# EAGLE design CFO_europroto_atmega328_mcp4822 (EAGLE 9.2.2)
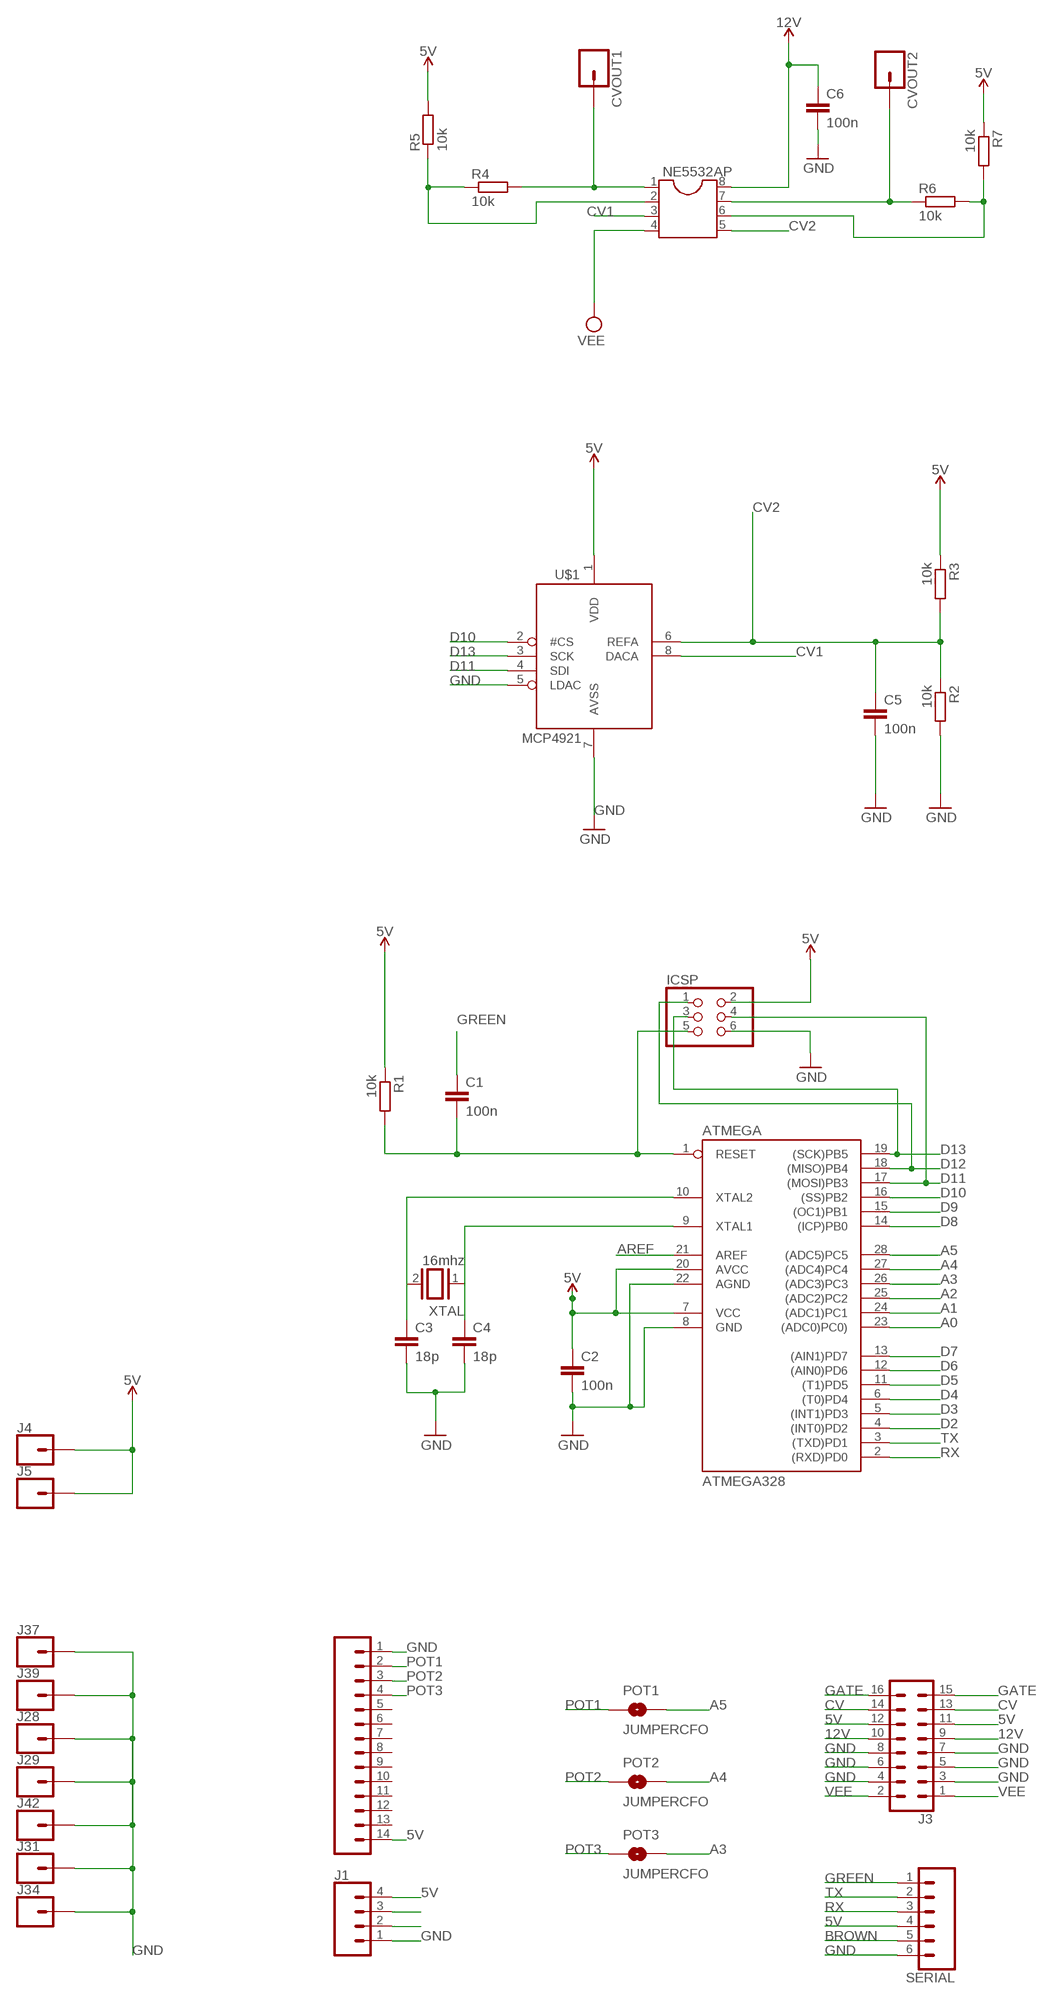
[diagram p0: schematic, sheet 1]

## Parts
ATMEGA  ATMEGA328  AT90S4433P  [DIL28-3]
C1  100n  C-EU050-025X075  [C050-025X075]
C2  100n  C-EU050-025X075  [C050-025X075]
C3  18p  C-EU050-025X075  [C050-025X075]
C4  18p  C-EU050-025X075  [C050-025X075]
C5  100n  C-EU050-025X075  [C050-025X075]
C6  100n  C-EU050-025X075  [C050-025X075]
CVOUT1  CONN_01  [1X01]
CVOUT2  CONN_01  [1X01]
ICSP  PINHD-2X3  [2X03]
J1  CONN_04  [1X04]
J2  CONN_14SQUARE  [1X14]
J3  CONN_08X2_SHROUD  [2X8-SHROUDED_LOCK]
J4  CONN_01  [1X01]
J5  CONN_01  [1X01]
J28  CONN_01  [1X01]
J29  CONN_01  [1X01]
J31  CONN_01  [1X01]
J34  CONN_01  [1X01]
J37  CONN_01  [1X01]
J39  CONN_01  [1X01]
J42  CONN_01  [1X01]
NE5532AP  DIL8  [DIL08]
POT1  JUMPERCFO  [SMT-JUMPER_2_NO_NO-SILK_ROUND]
POT2  JUMPERCFO  [SMT-JUMPER_2_NO_NO-SILK_ROUND]
POT3  JUMPERCFO  [SMT-JUMPER_2_NO_NO-SILK_ROUND]
R1  10k  R-EU_0207/10  [0207/10]
R2  10k  R-EU_0207/10  [0207/10]
R3  10k  R-EU_0207/10  [0207/10]
R4  10k  R-EU_0207/10  [0207/10]
R5  10k  R-EU_0207/10  [0207/10]
R6  10k  R-EU_0207/10  [0207/10]
R7  10k  R-EU_0207/10  [0207/10]
SERIAL  CONN_06SILK_FEMALE_PTH  [1X06]
U$1  MCP4921  [DIL08]
XTAL  16mhz  XTAL/S  [QS]

## Nets
5V: ATMEGA.7(VCC) ATMEGA.20(AVCC) C2.1 ICSP.2 J1.4 J2.14 J3.11 J3.12 J4.1 J5.1 R1.1 R3.1 R5.2 R7.1 SERIAL.4 U$1.1(VDD)
12V: C6.1 J3.9 J3.10 NE5532AP.8
A0: ATMEGA.23((ADC0)PC0))
A1: ATMEGA.24((ADC1)PC1)
A2: ATMEGA.25((ADC2)PC2)
A3: ATMEGA.26((ADC3)PC3) POT3.2
A4: ATMEGA.27((ADC4)PC4) POT2.2
A5: ATMEGA.28((ADC5)PC5) POT1.2
AREF: ATMEGA.21(AREF)
BROWN: SERIAL.5
CV: J3.13 J3.14
CV1: NE5532AP.3 U$1.8(DACA)
CV2: C5.1 NE5532AP.5 R2.1 R3.2 U$1.6(REFA)
CVOUT1: CVOUT1.1 NE5532AP.1 R4.2
CVOUT2: CVOUT2.1 NE5532AP.7 R6.1
D2: ATMEGA.4((INT0)PD2)
D3: ATMEGA.5((INT1)PD3)
D4: ATMEGA.6((T0)PD4)
D5: ATMEGA.11((T1)PD5)
D6: ATMEGA.12((AIN0)PD6)
D7: ATMEGA.13((AIN1)PD7)
D8: ATMEGA.14((ICP)PB0)
D9: ATMEGA.15((OC1)PB1)
D10: ATMEGA.16((SS)PB2) U$1.2(#CS)
D11: ATMEGA.17((MOSI)PB3) ICSP.4 U$1.4(SDI)
D12: ATMEGA.18((MISO)PB4) ICSP.1
D13: ATMEGA.19((SCK)PB5) ICSP.3 U$1.3(SCK)
GATE: J3.15 J3.16
GND: ATMEGA.8(GND) ATMEGA.22(AGND) C2.2 C3.2 C4.2 C5.2 C6.2 ICSP.6 J1.1 J2.1 J3.3 J3.4 J3.5 J3.6 J3.7 J3.8 J28.1 J29.1 J31.1 J34.1 J37.1 J39.1 J42.1 R2.2 SERIAL.6 U$1.5(LDAC) U$1.7(AVSS)
GREEN: C1.1 SERIAL.1
N$1: ATMEGA.10(XTAL2) C3.1 XTAL.2
N$2: NE5532AP.6 R6.2 R7.2
N$4: NE5532AP.2 R4.1 R5.1
N$9: ATMEGA.9(XTAL1) C4.1 XTAL.1
N$185: J1.3
N$186: J1.2
POT1: J2.2 POT1.1
POT2: J2.3 POT2.1
POT3: J2.4 POT3.1
RESET: ATMEGA.1(RESET) C1.2 ICSP.5 R1.2
RX: ATMEGA.2((RXD)PD0) SERIAL.3
TX: ATMEGA.3((TXD)PD1) SERIAL.2
VEE: J3.1 J3.2 NE5532AP.4
Unconnected: J2.5 J2.6 J2.7 J2.8 J2.9 J2.10 J2.11 J2.12 J2.13

## Library data of the parts
ATMEGA = atmel:AT90S4433: MICROCONTROLLER 4 Kbytes FLASH 128 bytes SRAM 256 bytes EEPROM UART 6-channel 10 bit ADC; OC_FARNELL: unknown; OC_NEWARK: unknown
C1-C6 = rcl:C-EU: CAPACITOR, European symbol; SPICEPREFIX: C
CVOUT1 CVOUT2 J4 J5 J28 J29 J31 J34 J37 J39 J42 = CFO:CONN_01: Single connection point. Often used as Generic Header-pin footprint for 0.1 inch spaced/style header connections On any of the 0.1 inch spaced packages, you can populate with these: Break Away Headers - Straight <https://www.sparkfun.com/products/116> (PRT-00116) Break Away Male Headers - Right Angle <https://www.sparkfun.com/products/553> (PRT-00553) Female Headers <https://www.sparkfun.com/products/115> (PRT-00115) Break Away Headers - Machine Pin <https://www.sparkfun.com/products/117> (PRT-00117) Break Away Female Headers - Swiss Machine Pin <https://www.sparkfun.com/products/743> (PRT-00743) This device is also useful as a general connection point to wire up your design to another part of your project. Our various solder wires solder well into these plated through hole pads. Hook-Up Wire - Assortment (Stranded, 22 AWG) <https://www.sparkfun.com/products/11375> (PRT-11375) Hook-Up Wire - Assortment (Solid Core, 22 AWG) <https://www.sparkfun.com/products/11367> (PRT-11367) View the entire wire category on our website here <https://www.sparkfun.com/categories/141> Special notes: SMTSO-256-ET is a "flush mount" nut for a 4-40 screw. We mostly use this on specialty testbeds; it is a nice way to connect hardware to your PCB at an adjustable hieght. Also note, the SNAP packages are for using a snappable style connector. We sell a baggie of snaps and they are also used on two LilyPad designs: Snap Assortment - 30 pack (male and female) <https://www.sparkfun.com/products/11347> (DEV-11347) LilyPad Arduino SimpleSnap <https://www.sparkfun.com/products/10941> (DEV-10941) LilyPad SimpleSnap Protoboard <https://www.sparkfun.com/products/10940> (DEV-10940)
ICSP = SparkFun-Connectors:PINHD-2X3: PIN HEADER
J1 = CFO:CONN_04: Multi connection point. Often used as Generic Header-pin footprint for 0.1 inch spaced/style header connections On any of the 0.1 inch spaced packages, you can populate with these: Break Away Headers - Straight <https://www.sparkfun.com/products/116> (PRT-00116) Break Away Male Headers - Right Angle <https://www.sparkfun.com/products/553> (PRT-00553) Female Headers <https://www.sparkfun.com/products/115> (PRT-00115) Break Away Headers - Machine Pin <https://www.sparkfun.com/products/117> (PRT-00117) Break Away Female Headers - Swiss Machine Pin <https://www.sparkfun.com/products/743> (PRT-00743) For SCREWTERMINALS and SPRING TERMINALS visit here: Screw Terimnals on SparkFun.com <https://www.sparkfun.com/search/results?term=Screw+Terminals> (5mm/3.5mm/2.54mm spacing) This device is also useful as a general connection point to wire up your design to another part of your project. Our various solder wires solder well into these plated through hole pads. Hook-Up Wire - Assortment (Stranded, 22 AWG) <https://www.sparkfun.com/products/11375> (PRT-11375) Hook-Up Wire - Assortment (Solid Core, 22 AWG) <https://www.sparkfun.com/products/11367> (PRT-11367) View the entire wire category on our website here <https://www.sparkfun.com/categories/141> Special notes: Molex polarized connector foot print use with SKU : PRT-08231 with associated crimp pins and housings. 1MM SMD Version SKU: PRT-10208; PROD_ID: CONN-09696; SPICEPREFIX: E
J2 = CFO:CONN_14: Multi connection point. Often used as Generic Header-pin footprint for 0.1 inch spaced/style header connections On any of the 0.1 inch spaced packages, you can populate with these: Break Away Headers - Straight <https://www.sparkfun.com/products/116> (PRT-00116) Break Away Male Headers - Right Angle <https://www.sparkfun.com/products/553> (PRT-00553) Female Headers <https://www.sparkfun.com/products/115> (PRT-00115) Break Away Headers - Machine Pin <https://www.sparkfun.com/products/117> (PRT-00117) Break Away Female Headers - Swiss Machine Pin <https://www.sparkfun.com/products/743> (PRT-00743) For SCREWTERMINALS and SPRING TERMINALS visit here: Screw Terimnals on SparkFun.com <https://www.sparkfun.com/search/results?term=Screw+Terminals> (5mm/3.5mm/2.54mm spacing) This device is also useful as a general connection point to wire up your design to another part of your project. Our various solder wires solder well into these plated through hole pads. Hook-Up Wire - Assortment (Stranded, 22 AWG) <https://www.sparkfun.com/products/11375> (PRT-11375) Hook-Up Wire - Assortment (Solid Core, 22 AWG) <https://www.sparkfun.com/products/11367> (PRT-11367) View the entire wire category on our website here <https://www.sparkfun.com/categories/141> Special notes: Molex polarized connector foot print use with SKU : PRT-08231 with associated crimp pins and housings. 1MM SMD Version SKU: PRT-10208 NOTES ON THE VARIANTS LOCK and LOCK_LONGPADS... This footprint was designed to help hold the alignment of a through-hole component (i.e. 6-pin header) while soldering it into place. You may notice that each hole has been shifted either up or down by 0.005 of an inch from it's more standard position (which is a perfectly straight line). This slight alteration caused the pins (the squares in the middle) to touch the edges of the holes. Because they are alternating, it causes a "brace" to hold the component in place. 0.005 has proven to be the perfect amount of "off-center" position when using our standard breakaway headers. Although looks a little odd when you look at the bare footprint, once you have a header in there, the alteration is very hard to notice. Also,if you push a header all the way into place, it is covered up entirely on the bottom side.; SPICEPREFIX: X
J3 = CFO:CONN_08X2: Multi connection point. Often used as Generic Header-pin footprint for 0.1 inch spaced/style header connections You can populate with any combo of single row headers, but if you'd like an exact match, check this: Header - 2x8 (Male, 0.1") <https://www.sparkfun.com/products/13156> (PRT-13156) On any of the 0.1 inch spaced packages, you can populate with these: Break Away Headers - Straight <https://www.sparkfun.com/products/116> (PRT-00116) Break Away Male Headers - Right Angle <https://www.sparkfun.com/products/553> (PRT-00553) Female Headers <https://www.sparkfun.com/products/115> (PRT-00115) Break Away Headers - Machine Pin <https://www.sparkfun.com/products/117> (PRT-00117) Break Away Female Headers - Swiss Machine Pin <https://www.sparkfun.com/products/743> (PRT-00743)
NE5532AP = ic-package:DIL8: Dual In Line / Socket
POT1-POT3 = CFO:JUMPER: Normally open jumper This jumper has two pads in close proximity to each other. Apply solder to close the connection.
R1-R7 = rcl:R-EU_: RESISTOR, European symbol; SPICEPREFIX: R
SERIAL = SparkFun-Connectors:CONN_06: Multi connection point. Often used as Generic Header-pin footprint for 0.1 inch spaced/style header connections On any of the 0.1 inch spaced packages, you can populate with these: Break Away Headers - Straight <https://www.sparkfun.com/products/116> (PRT-00116) Break Away Male Headers - Right Angle <https://www.sparkfun.com/products/553> (PRT-00553) Female Headers <https://www.sparkfun.com/products/115> (PRT-00115) Break Away Headers - Machine Pin <https://www.sparkfun.com/products/117> (PRT-00117) Break Away Female Headers - Swiss Machine Pin <https://www.sparkfun.com/products/743> (PRT-00743) Arduino Stackable Header - 6 Pin <https://www.sparkfun.com/products/9280> (PRT-09280) For SCREWTERMINALS and SPRING TERMINALS visit here: Screw Terimnals on SparkFun.com <https://www.sparkfun.com/search/results?term=Screw+Terminals> (5mm/3.5mm/2.54mm spacing) This device is also useful as a general connection point to wire up your design to another part of your project. Our various solder wires solder well into these plated through hole pads. Hook-Up Wire - Assortment (Stranded, 22 AWG) <https://www.sparkfun.com/products/11375> (PRT-11375) Hook-Up Wire - Assortment (Solid Core, 22 AWG) <https://www.sparkfun.com/products/11367> (PRT-11367) View the entire wire category on our website here <https://www.sparkfun.com/categories/141>; PROD_ID: CONN-08437
U$1 = adafruit:MCP4921
XTAL = special:XTAL/S: CRYSTAL

## Board
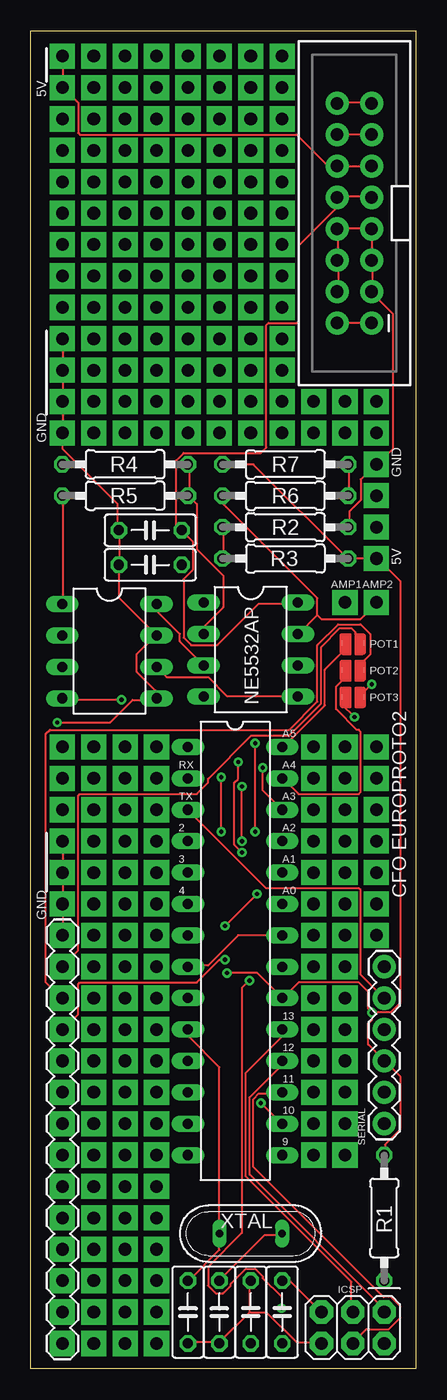
[diagram p1: board, top side]
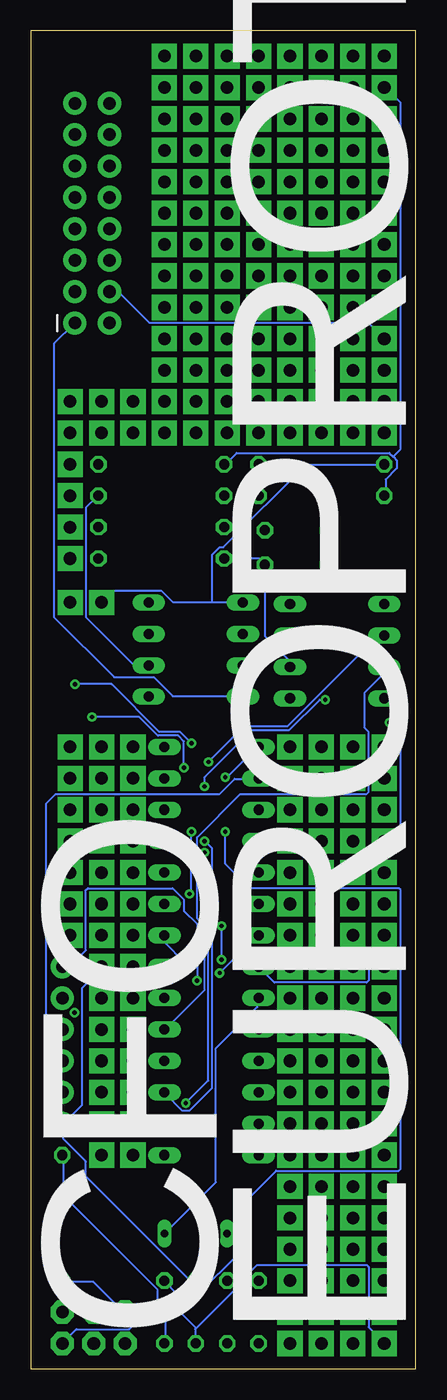
[diagram p2: board, bottom side, seen from below]

Size 31.11 x 108.22 mm. Coordinates in mm from the lower left corner, seen from the top.
Outline: 31.11,0 0,0 0,108.22 31.11,108.22 31.11,0
Copper layers (1*16): Top 0.035mm / dielectric 1.5mm / Bottom 0.035mm
Design rules "default": minimum track width 6mil, minimum drill 0.35mm, track to track 6mil, track to pad 6mil, pad to pad 6mil, via to via 6mil, smd to smd 6mil, copper to edge 40mil, drill to drill 6mil, minimum pad ring 10mil, minimum via ring 8mil, stop-mask expansion 4mil, vias tented up to drill 0mil, thermal gap 10mil

### Footprints (pad centres in the part's own frame; a part is rotated, then mirrored left to right if it is on the bottom)
DIL28-3 = drill 0.813 long: 1 -16.51,-3.81; 2 -13.97,-3.81; 3 -11.43,-3.81; 4 -8.89,-3.81; 5 -6.35,-3.81; 6 -3.81,-3.81; 7 -1.27,-3.81; 8 1.27,-3.81; 9 3.81,-3.81; 10 6.35,-3.81; 11 8.89,-3.81; 12 11.43,-3.81; 13 13.97,-3.81; 14 16.51,-3.81; 15 16.51,3.81; 16 13.97,3.81; 17 11.43,3.81; 18 8.89,3.81; 19 6.35,3.81; 20 3.81,3.81; 21 1.27,3.81; 22 -1.27,3.81; 23 -3.81,3.81; 24 -6.35,3.81; 25 -8.89,3.81; 26 -11.43,3.81; 27 -13.97,3.81; 28 -16.51,3.81
C050-025X075 = drill 0.813 octagon: 1 -2.54,0; 2 2.54,0
1X01 = drill 1.016 pad 2.032 square: 1 0,0
2X03 = drill 1.016 pad 1.88 octagon: 1 -2.54,-1.27; 2 -2.54,1.27; 3 0,-1.27; 4 0,1.27; 5 2.54,-1.27; 6 2.54,1.27
1X04 = drill 1.016 pad 2.032 square: 1 0,0; 2 2.54,0; 3 5.08,0; 4 7.62,0
1X14 = drill 1.016 pad 2.032 square: 1 0,0; 2 2.54,0; 3 5.08,0; 4 7.62,0; 5 10.16,0; 6 12.7,0; 7 15.24,0; 8 17.78,0; 9 20.32,0; 10 22.86,0; 11 25.4,0; 12 27.94,0; 13 30.48,0; 14 33.02,0
2X8-SHROUDED_LOCK = drill 1.016 pad 1.88: 1 -1.397,8.89; 2 1.397,8.89; 3 -1.397,6.35; 4 1.397,6.35; 5 -1.397,3.81; 6 1.397,3.81; 7 -1.397,1.27; 8 1.397,1.27; 9 -1.397,-1.27; 10 1.397,-1.27; 11 -1.397,-3.81; 12 1.397,-3.81; 13 -1.397,-6.35; 14 1.397,-6.35; 15 -1.397,-8.89; 16 1.397,-8.89
DIL08 = drill 0.813 long: 1 -3.81,-3.81; 2 -1.27,-3.81; 3 1.27,-3.81; 4 3.81,-3.81; 5 3.81,3.81; 6 1.27,3.81; 7 -1.27,3.81; 8 -3.81,3.81
SMT-JUMPER_2_NO_NO-SILK_ROUND = smd 0.152 x 0.305: 1 -0.889,0; 2 0.889,0
0207/10 = drill 0.813 octagon: 1 -5.08,0; 2 5.08,0
1X06 = drill 1.016 pad 1.88: 1 0,0; 2 2.54,0; 3 5.08,0; 4 7.62,0; 5 10.16,0; 6 12.7,0
QS = drill 0.61 long: 1 -2.54,0; 2 2.54,0

### Placement (x,y rotation side)
ATMEGA  16.51,33.78 270 top
C1  20.32,4.57 90 top
C2  17.78,4.57 90 top
C3  12.7,4.57 270 top
C4  15.24,4.57 270 top
C5  9.65,65.02 180 top
C6  9.65,67.82 180 top
CVOUT1  25.4,61.98 90 top
CVOUT2  27.94,61.98 90 top
ICSP  26.04,3.3 180 top
J1  27.94,73.15 270 top
J2  2.54,35.05 270 top
J3  26.16,93.47 180 top
J4  2.54,106.17 0 top
J5  2.54,103.63 0 top
J28  2.54,83.31 0 top
J29  2.54,42.67 0 top
J31  2.54,80.77 0 top
J34  2.54,78.23 0 top
J37  2.54,75.69 0 top
J39  2.54,40.13 0 top
J42  2.54,37.59 0 top
NE5532AP  17.78,58.17 270 top
POT1  26.04,58.67 180 top
POT2  26.04,56.52 180 top
POT3  26.04,54.36 180 top
R1  28.57,12.19 270 top
R2  20.57,68.07 0 top
R3  20.57,65.53 180 top
R4  7.62,73.15 180 top
R5  7.62,70.61 180 top
R6  20.57,70.61 0 top
R7  20.57,73.15 0 top
SERIAL  28.57,32.51 270 top
U$1  6.35,58.04 270 top
XTAL  17.78,10.92 180 top

### Tracks (layer width: path | path; a pad name or v marks a point on that pad's centre or on a via)
5V  (via drill 0.35)
  Top 0.152: v27.58,28.8 27.58,28.19 27.28,27.89 27.28,26.21 28.5,24.99 SERIAL.4 28.65,24.84 29.87,23.62 29.87,19.36 28.65,18.14 28.65,17.37 R1.1 | v27.58,28.8 27.28,29.11 27.28,30.48 26.52,31.24 21.64,31.24 20.42,30.02 ATMEGA.20 18.29,32 v15.85,32 | J3.11 27.43,97.23 24.84,97.23 J3.12 24.69,97.38 23.93,97.38 21.49,99.82 3.96,99.82 3.81,99.97 3.81,102.41 2.59,103.63 | 2.59,103.63 2.59,106.07 J4.1 | 2.59,103.63 J5.1 | U$1.1 2.59,61.87 2.59,70.56 R5.2 | R7.1 17.98,73.15 25.6,65.53 R3.1 J1.4 28.04,65.53 29.87,63.7 29.87,29.57 29.11,28.8 v27.58,28.8
  Bottom 0.152: 17.83,3.2 17.83,3.35 19.96,5.49 20.88,5.49 | 17.83,3.2 17.83,2.13 C2.1 | 20.88,5.49 23.16,3.2 27.43,3.2 28.5,2.13 ICSP.2 | 17.83,3.2 14.33,6.71 14.33,6.86 12.8,8.38 3.96,8.38 3.81,8.23 3.81,3.35 2.59,2.13 J2.14 | v15.85,32 12.8,35.05 ATMEGA.7 | 20.88,5.49 20.88,6.4 28.5,14.02 28.5,17.22 R1.1 | 1.83,73.76 2.13,74.07 14.48,74.07 15.39,73.15 R7.1 | 1.83,73.76 1.52,73.46 1.52,72.85 2.44,71.93 2.44,70.71 R5.2 | 1.83,73.76 1.22,74.37 1.22,102.41 2.44,103.63 J5.1
12V
  Top 0.152: J3.9 27.43,94.79 24.84,94.79 J3.10 24.69,94.64 24.69,93.88 21.64,90.83 21.64,84.73 21.49,84.58 19.2,84.58 19.05,84.43 19.05,74.52 18.59,74.07 12.34,74.07 11.73,73.46 11.73,68.28 C6.1 13.11,66.9 13.11,64.62 12.34,63.86 12.34,59.13 12.95,58.52 15.09,58.52 18.44,61.87 21.49,61.87 NE5532AP.8
A3  (via drill 0.35)
  Top 0.152: v18.75,48.62 18.75,46.79 ATMEGA.26 | POT3.2 25.15,53.74 v26.17,52.72
  Bottom 0.152: v18.75,48.62 18.75,50.75 19.2,51.21 20.85,51.21 22.36,52.72 v26.17,52.72
A4
  Top 0.152: POT2.2 25.15,55.63 24.69,55.17 24.69,53.34 26.36,51.66 26.52,51.66 26.67,51.51 26.67,46.63 26.52,46.48 21.64,46.48 20.42,47.7 ATMEGA.27
A5
  Top 0.152: POT1.2 25.15,57.91 23.77,56.54 23.77,53.65 20.42,50.29 ATMEGA.28
CV
  Top 0.152: J3.13 J3.14
CV1
  Top 0.152: NE5532AP.3 12.04,58.83 12.04,59.44 10.21,61.27 10.21,61.72 U$1.8
CV2
  Top 0.152: R3.2 15.54,65.53 15.54,67.97 R2.1 | NE5532AP.5 21.49,54.41 15.85,54.41 14.33,55.93 10.97,55.93 10.21,56.69 U$1.6
  Bottom 0.152: U$1.6 10.21,56.84 10.21,57.3 12.19,59.28 C5.1 12.19,65.08 12.65,65.53 R3.2
CVOUT1
  Bottom 0.152: 16.46,62.03 19.66,62.03 20.57,62.94 24.38,62.94 25.3,62.03 CVOUT1.1 | 16.46,62.03 14.02,62.03 NE5532AP.1 | R4.2 8.84,73.15 15.54,66.45 15.85,66.45 16.46,65.84 16.46,62.03
CVOUT2
  Top 0.152: 23.16,60.96 23.16,62.33 15.54,69.95 15.54,70.56 R6.1 | 23.16,60.96 21.64,59.44 NE5532AP.7 | 23.16,60.96 23.47,60.66 26.67,60.66 27.89,61.87 CVOUT2.1
D10  (via drill 0.35)
  Top 0.152: v16.76,49.07 16.76,47.7 16.46,47.4 16.46,42.37 v17.07,41.76 | v18.59,21.49 20.27,19.81 ATMEGA.16
  Bottom 0.152: v16.76,49.07 13.87,51.97 10.36,51.97 3.05,59.28 2.59,59.28 U$1.2 | v17.07,41.76 17.07,36.27 16.76,35.97 16.76,23.32 v18.59,21.49
D11  (via drill 0.35)
  Top 0.152: ATMEGA.17 20.27,22.25 18.44,22.25 17.98,21.79 17.98,16.31 28.5,5.79 29.11,5.79 29.87,5.03 29.87,4.12 28.96,3.2 27.13,3.2 26.06,2.13 ICSP.4 | v7.32,54.1 2.59,54.1 U$1.4 | v17.07,42.67 v17.07,47.09
  Bottom 0.152: v7.32,54.1 7.77,54.1 10.21,51.66 13.26,51.66 17.07,47.85 v17.07,47.09 | v17.07,42.67 16.46,42.06 16.46,22.71 18.29,20.88 18.9,20.88 20.27,22.25 ATMEGA.17
D12
  Top 0.152: ATMEGA.18 20.27,24.84 20.27,24.54 17.68,21.95 17.68,15.7 28.5,4.88 28.5,4.57 ICSP.1
D13
  Top 0.152: ATMEGA.19 20.27,27.43 20.27,26.82 17.37,23.93 17.37,15.54 25.91,7.01 25.91,4.57 ICSP.3
  Bottom 0.152: U$1.3 2.59,56.69 2.59,56.24 4.12,54.71 4.12,51.82 3.81,51.51 3.81,46.63 3.96,46.48 14.17,46.48 17.68,42.98 17.68,36.42 17.07,35.81 17.07,30.63 20.27,27.43 ATMEGA.19
GATE
  Top 0.152: J3.16 24.84,102.41 27.43,102.41 J3.15
GND  (via drill 0.35)
  Top 0.152: R2.2 25.76,68.12 25.76,69.34 26.67,70.26 26.67,71.93 27.89,73.15 J1.1 28.04,73.15 29.26,74.37 29.26,85.34 27.58,87.02 J3.3 27.58,87.17 27.58,89.61 J3.5 27.58,89.76 27.58,92.2 J3.7 24.84,92.2 | J3.4 24.84,87.17 24.84,89.61 J3.6 24.84,89.76 24.84,92.2 | 24.84,92.2 J3.8 | 2.59,80.77 2.59,83.21 J28.1 | 2.59,80.77 2.59,78.33 J34.1 2.59,78.18 2.59,75.74 J37.1 2.59,75.59 2.59,74.37 7.01,69.95 7.01,67.82 C6.2 7.16,67.82 7.16,65.08 C5.2 7.16,64.92 7.16,62.33 10.06,59.44 U$1.7 10.06,59.28 8.53,57.76 8.53,56.39 10.06,54.86 10.06,54.25 U$1.5 10.06,54.1 8.23,54.1 6.4,52.27 v2.13,52.27 | 2.59,80.77 J31.1 | ATMEGA.22 16.76,35.05 14.33,32.61 12.8,32.61 ATMEGA.8 | J2.1 2.59,35.05 2.59,37.49 J42.1 2.59,37.64 2.59,40.08 J39.1 2.59,40.23 2.59,42.67 J29.1 | 15.24,2.13 12.8,2.13 C3.2 | 17.68,4.57 17.68,7.01 C2.2 | 15.24,2.13 17.68,4.57 | 15.24,2.13 C4.2 | 17.68,4.57 19.05,4.57 21.49,2.13 23.47,2.13 ICSP.6
  Bottom 0.152: J28.1 3.81,84.58 21.49,84.58 23.93,87.02 24.69,87.02 J3.4 | ATMEGA.8 11.43,31.24 3.96,31.24 3.81,31.39 3.81,33.83 2.59,35.05 J2.1 | 28.5,19.81 28.5,18.59 26.67,16.76 26.67,15.54 18.29,7.16 17.83,7.16 C2.2 | 28.5,19.81 26.98,21.34 26.98,30.79 26.52,31.24 19.66,31.24 18.75,32.16 18.75,32.92 20.27,34.44 20.27,35.05 ATMEGA.22 | 28.5,19.81 SERIAL.6 | v2.13,52.27 1.22,51.36 1.22,43.89 2.44,42.67 J29.1
GREEN  (via drill 0.35)
  Top 0.152: v20.27,4.88 20.27,5.79 18.75,7.32 18.75,7.47 18.14,8.08 17.37,8.08 16.15,6.86 16.15,6.71 15.54,6.1 14.94,6.1 14.33,6.71 14.33,8.23 17.07,10.97 17.07,30.79 v17.68,31.39
  Bottom 0.152: v20.27,4.88 20.27,2.13 C1.1 | v17.68,31.39 17.68,35.97 18.75,37.03 18.75,37.95 19.66,38.86 26.52,38.86 26.67,38.71 26.67,33.83 27.89,32.61 28.5,32.61 SERIAL.1
N$1
  Top 0.152: C3.1 12.8,7.16 15.24,9.6 XTAL.2 15.24,24.38 12.8,26.82 12.8,27.43 ATMEGA.10
N$2
  Top 0.152: R7.2 25.76,73.15 25.76,70.71 R6.2
  Bottom 0.152: NE5532AP.6 21.64,57 22.86,57 26.67,60.81 26.67,69.65 25.76,70.56 R6.2
N$3  (via drill 1.02 pad 2.03)
  other vias: 5.08,2.03
N$4
  Top 0.152: R4.1 12.8,73.15 12.8,70.71 R5.1 12.8,70.56 13.41,69.95 13.41,66.29 15.54,64.16 15.54,61.57 14.02,60.05 14.02,59.44 NE5532AP.2
N$5  (via drill 1.02 pad 2.03)
  other vias: 7.62,2.03
N$6  (via drill 1.02 pad 2.03)
  other vias: 10.16,2.03
N$7  (via drill 1.02 pad 2.03)
  other vias: 10.16,4.57
N$8  (via drill 1.02 pad 2.03)
  other vias: 7.62,4.57
N$9
  Top 0.152: XTAL.1 20.27,10.82 18.9,10.82 15.24,7.16 C4.1
  Bottom 0.152: XTAL.1 16.15,15.09 16.15,25.91 12.8,29.26 12.8,29.87 ATMEGA.9
N$10  (via drill 1.02 pad 2.03)
  other vias: 5.08,4.57
N$11  (via drill 1.02 pad 2.03)
  other vias: 5.08,7.11
N$12  (via drill 1.02 pad 2.03)
  other vias: 7.62,7.11
N$13  (via drill 1.02 pad 2.03)
  other vias: 10.16,7.11
N$14  (via drill 1.02 pad 2.03)
  other vias: 10.16,9.65
N$15  (via drill 1.02 pad 2.03)
  other vias: 7.62,9.65
N$16  (via drill 1.02 pad 2.03)
  other vias: 5.08,9.65
N$17  (via drill 1.02 pad 2.03)
  other vias: 5.08,12.19
N$18  (via drill 1.02 pad 2.03)
  other vias: 7.62,12.19
N$19  (via drill 1.02 pad 2.03)
  other vias: 10.16,12.19
N$20  (via drill 1.02 pad 2.03)
  other vias: 10.16,14.73
N$21  (via drill 1.02 pad 2.03)
  other vias: 7.62,14.73
N$22  (via drill 1.02 pad 2.03)
  other vias: 5.08,14.73
N$23  (via drill 1.02 pad 2.03)
  other vias: 5.08,17.27
N$24  (via drill 1.02 pad 2.03)
  other vias: 7.62,17.27
N$25  (via drill 1.02 pad 2.03)
  other vias: 10.16,17.27
N$26  (via drill 1.02 pad 2.03)
  other vias: 10.16,19.81
N$27  (via drill 1.02 pad 2.03)
  other vias: 7.62,19.81
N$28  (via drill 1.02 pad 2.03)
  other vias: 5.08,19.81
N$29  (via drill 1.02 pad 2.03)
  other vias: 5.08,22.35
N$30  (via drill 1.02 pad 2.03)
  other vias: 7.62,22.35
N$31  (via drill 1.02 pad 2.03)
  other vias: 10.16,22.35
N$32  (via drill 1.02 pad 2.03)
  other vias: 10.16,24.89
N$33  (via drill 1.02 pad 2.03)
  other vias: 7.62,24.89
N$34  (via drill 1.02 pad 2.03)
  other vias: 5.08,24.89
N$35  (via drill 1.02 pad 2.03)
  other vias: 5.08,27.43
N$36  (via drill 1.02 pad 2.03)
  other vias: 7.62,27.43
N$37  (via drill 1.02 pad 2.03)
  other vias: 10.16,27.43
N$38  (via drill 1.02 pad 2.03)
  other vias: 10.16,29.97
N$39  (via drill 1.02 pad 2.03)
  other vias: 7.62,29.97
N$40  (via drill 1.02 pad 2.03)
  other vias: 5.08,29.97
N$41  (via drill 1.02 pad 2.03)
  other vias: 5.08,32.51
N$42  (via drill 1.02 pad 2.03)
  other vias: 7.62,32.51
N$43  (via drill 1.02 pad 2.03)
  other vias: 10.16,32.51
N$44  (via drill 1.02 pad 2.03)
  other vias: 10.16,35.05
N$45  (via drill 1.02 pad 2.03)
  other vias: 7.62,35.05
N$46  (via drill 1.02 pad 2.03)
  other vias: 5.08,35.05
N$47  (via drill 1.02 pad 2.03)
  other vias: 5.08,37.59
N$48  (via drill 1.02 pad 2.03)
  other vias: 7.62,37.59
N$49  (via drill 1.02 pad 2.03)
  other vias: 10.16,37.59
N$50  (via drill 1.02 pad 2.03)
  other vias: 10.16,40.13
N$51  (via drill 1.02 pad 2.03)
  other vias: 7.62,40.13
N$52  (via drill 1.02 pad 2.03)
  other vias: 5.08,40.13
N$53  (via drill 1.02 pad 2.03)
  other vias: 5.08,42.67
N$54  (via drill 1.02 pad 2.03)
  other vias: 7.62,42.67
N$55  (via drill 1.02 pad 2.03)
  other vias: 10.16,42.67
N$56  (via drill 1.02 pad 2.03)
  other vias: 10.16,45.21
N$57  (via drill 1.02 pad 2.03)
  other vias: 7.62,45.21
N$58  (via drill 1.02 pad 2.03)
  other vias: 5.08,45.21
N$59  (via drill 1.02 pad 2.03)
  other vias: 2.54,45.21
N$60  (via drill 1.02 pad 2.03)
  other vias: 2.54,47.75
N$61  (via drill 1.02 pad 2.03)
  other vias: 5.08,47.75
N$62  (via drill 1.02 pad 2.03)
  other vias: 7.62,47.75
N$63  (via drill 1.02 pad 2.03)
  other vias: 10.16,47.75
N$64  (via drill 1.02 pad 2.03)
  other vias: 10.16,50.29
N$65  (via drill 1.02 pad 2.03)
  other vias: 7.62,50.29
N$66  (via drill 1.02 pad 2.03)
  other vias: 5.08,50.29
N$67  (via drill 1.02 pad 2.03)
  other vias: 2.54,50.29
N$68  (via drill 1.02 pad 2.03)
  other vias: 22.86,17.27
N$71  (via drill 1.02 pad 2.03)
  other vias: 25.4,17.27
N$72  (via drill 1.02 pad 2.03)
  other vias: 25.4,19.81
N$73  (via drill 1.02 pad 2.03)
  other vias: 22.86,19.81
N$74  (via drill 1.02 pad 2.03)
  other vias: 22.86,22.35
N$75  (via drill 1.02 pad 2.03)
  other vias: 25.4,22.35
N$76  (via drill 1.02 pad 2.03)
  other vias: 25.4,24.89
N$77  (via drill 1.02 pad 2.03)
  other vias: 22.86,24.89
N$78  (via drill 1.02 pad 2.03)
  other vias: 22.86,27.43
N$79  (via drill 1.02 pad 2.03)
  other vias: 25.4,27.43
N$80  (via drill 1.02 pad 2.03)
  other vias: 25.4,29.97
N$81  (via drill 1.02 pad 2.03)
  other vias: 22.86,29.97
N$82  (via drill 1.02 pad 2.03)
  other vias: 22.86,32.51
N$84  (via drill 1.02 pad 2.03)
  other vias: 25.4,32.51
N$85  (via drill 1.02 pad 2.03)
  other vias: 25.4,35.05
N$86  (via drill 1.02 pad 2.03)
  other vias: 22.86,35.05
N$87  (via drill 1.02 pad 2.03)
  other vias: 27.94,35.05
N$88  (via drill 1.02 pad 2.03)
  other vias: 27.94,37.59
N$89  (via drill 1.02 pad 2.03)
  other vias: 25.4,37.59
N$90  (via drill 1.02 pad 2.03)
  other vias: 22.86,37.59
N$91  (via drill 1.02 pad 2.03)
  other vias: 22.86,40.13
N$92  (via drill 1.02 pad 2.03)
  other vias: 25.4,40.13
N$93  (via drill 1.02 pad 2.03)
  other vias: 27.94,40.13
N$94  (via drill 1.02 pad 2.03)
  other vias: 27.94,42.67
N$95  (via drill 1.02 pad 2.03)
  other vias: 25.4,42.67
N$96  (via drill 1.02 pad 2.03)
  other vias: 22.86,42.67
N$97  (via drill 1.02 pad 2.03)
  other vias: 22.86,45.21
N$98  (via drill 1.02 pad 2.03)
  other vias: 25.4,45.21
N$99  (via drill 1.02 pad 2.03)
  other vias: 27.94,45.21
N$100  (via drill 1.02 pad 2.03)
  other vias: 27.94,47.75
N$101  (via drill 1.02 pad 2.03)
  other vias: 25.4,47.75
N$102  (via drill 1.02 pad 2.03)
  other vias: 22.86,47.75
N$103  (via drill 1.02 pad 2.03)
  other vias: 22.86,50.29
N$104  (via drill 1.02 pad 2.03)
  other vias: 25.4,50.29
N$105  (via drill 1.02 pad 2.03)
  other vias: 27.94,50.29
N$108  (via drill 1.02 pad 2.03)
  other vias: 5.08,106.17
N$109  (via drill 1.02 pad 2.03)
  other vias: 7.62,106.17
N$110  (via drill 1.02 pad 2.03)
  other vias: 10.16,106.17
N$111  (via drill 1.02 pad 2.03)
  other vias: 12.7,106.17
N$112  (via drill 1.02 pad 2.03)
  other vias: 15.24,106.17
N$113  (via drill 1.02 pad 2.03)
  other vias: 17.78,106.17
N$114  (via drill 1.02 pad 2.03)
  other vias: 20.32,106.17
N$115  (via drill 1.02 pad 2.03)
  other vias: 20.32,103.63
N$116  (via drill 1.02 pad 2.03)
  other vias: 17.78,103.63
N$117  (via drill 1.02 pad 2.03)
  other vias: 15.24,103.63
N$118  (via drill 1.02 pad 2.03)
  other vias: 12.7,103.63
N$119  (via drill 1.02 pad 2.03)
  other vias: 10.16,103.63
N$120  (via drill 1.02 pad 2.03)
  other vias: 7.62,103.63
N$121  (via drill 1.02 pad 2.03)
  other vias: 5.08,103.63
N$122  (via drill 1.02 pad 2.03)
  other vias: 5.08,101.09
N$123  (via drill 1.02 pad 2.03)
  other vias: 7.62,101.09
N$124  (via drill 1.02 pad 2.03)
  other vias: 10.16,101.09
N$125  (via drill 1.02 pad 2.03)
  other vias: 12.7,101.09
N$126  (via drill 1.02 pad 2.03)
  other vias: 15.24,101.09
N$127  (via drill 1.02 pad 2.03)
  other vias: 17.78,101.09
N$128  (via drill 1.02 pad 2.03)
  other vias: 20.32,101.09
N$129  (via drill 1.02 pad 2.03)
  other vias: 2.54,98.55
N$130  (via drill 1.02 pad 2.03)
  other vias: 5.08,96.01
N$131  (via drill 1.02 pad 2.03)
  other vias: 5.08,98.55
N$132  (via drill 1.02 pad 2.03)
  other vias: 2.54,101.09
N$133  (via drill 1.02 pad 2.03)
  other vias: 7.62,98.55
N$134  (via drill 1.02 pad 2.03)
  other vias: 10.16,98.55
N$135  (via drill 1.02 pad 2.03)
  other vias: 12.7,98.55
N$136  (via drill 1.02 pad 2.03)
  other vias: 15.24,98.55
N$137  (via drill 1.02 pad 2.03)
  other vias: 17.78,98.55
N$138  (via drill 1.02 pad 2.03)
  other vias: 20.32,98.55
N$139  (via drill 1.02 pad 2.03)
  other vias: 20.32,96.01
N$140  (via drill 1.02 pad 2.03)
  other vias: 17.78,96.01
N$141  (via drill 1.02 pad 2.03)
  other vias: 15.24,96.01
N$142  (via drill 1.02 pad 2.03)
  other vias: 12.7,96.01
N$143  (via drill 1.02 pad 2.03)
  other vias: 10.16,96.01
N$144  (via drill 1.02 pad 2.03)
  other vias: 7.62,96.01
N$145  (via drill 1.02 pad 2.03)
  other vias: 2.54,93.47
N$146  (via drill 1.02 pad 2.03)
  other vias: 2.54,96.01
N$147  (via drill 1.02 pad 2.03)
  other vias: 5.08,93.47
N$148  (via drill 1.02 pad 2.03)
  other vias: 7.62,93.47
N$149  (via drill 1.02 pad 2.03)
  other vias: 10.16,93.47
N$150  (via drill 1.02 pad 2.03)
  other vias: 12.7,93.47
N$151  (via drill 1.02 pad 2.03)
  other vias: 15.24,93.47
N$152  (via drill 1.02 pad 2.03)
  other vias: 17.78,93.47
N$153  (via drill 1.02 pad 2.03)
  other vias: 20.32,93.47
N$154  (via drill 1.02 pad 2.03)
  other vias: 20.32,90.93
N$155  (via drill 1.02 pad 2.03)
  other vias: 17.78,90.93
N$156  (via drill 1.02 pad 2.03)
  other vias: 15.24,90.93
N$157  (via drill 1.02 pad 2.03)
  other vias: 12.7,90.93
N$158  (via drill 1.02 pad 2.03)
  other vias: 10.16,90.93
N$159  (via drill 1.02 pad 2.03)
  other vias: 7.62,90.93
N$160  (via drill 1.02 pad 2.03)
  other vias: 5.08,90.93
N$161  (via drill 1.02 pad 2.03)
  other vias: 2.54,90.93
N$162  (via drill 1.02 pad 2.03)
  other vias: 2.54,88.39
N$163  (via drill 1.02 pad 2.03)
  other vias: 5.08,88.39
N$164  (via drill 1.02 pad 2.03)
  other vias: 7.62,88.39
N$165  (via drill 1.02 pad 2.03)
  other vias: 10.16,88.39
N$166  (via drill 1.02 pad 2.03)
  other vias: 12.7,88.39
N$167  (via drill 1.02 pad 2.03)
  other vias: 15.24,88.39
N$168  (via drill 1.02 pad 2.03)
  other vias: 17.78,88.39
N$169  (via drill 1.02 pad 2.03)
  other vias: 20.32,88.39
N$170  (via drill 1.02 pad 2.03)
  other vias: 20.32,85.85
N$171  (via drill 1.02 pad 2.03)
  other vias: 17.78,85.85
N$172  (via drill 1.02 pad 2.03)
  other vias: 15.24,85.85
N$173  (via drill 1.02 pad 2.03)
  other vias: 12.7,85.85
N$174  (via drill 1.02 pad 2.03)
  other vias: 10.16,85.85
N$175  (via drill 1.02 pad 2.03)
  other vias: 7.62,85.85
N$176  (via drill 1.02 pad 2.03)
  other vias: 5.08,85.85
N$177  (via drill 1.02 pad 2.03)
  other vias: 2.54,85.85
N$178  (via drill 1.02 pad 2.03)
  other vias: 5.08,83.31
N$179  (via drill 1.02 pad 2.03)
  other vias: 7.62,83.31
N$180  (via drill 1.02 pad 2.03)
  other vias: 10.16,83.31
N$181  (via drill 1.02 pad 2.03)
  other vias: 12.7,83.31
N$182  (via drill 1.02 pad 2.03)
  other vias: 15.24,83.31
N$183  (via drill 1.02 pad 2.03)
  other vias: 17.78,83.31
N$184  (via drill 1.02 pad 2.03)
  other vias: 20.32,83.31
N$187  (via drill 1.02 pad 2.03)
  other vias: 20.32,80.77
N$188  (via drill 1.02 pad 2.03)
  other vias: 17.78,80.77
N$189  (via drill 1.02 pad 2.03)
  other vias: 15.24,80.77
N$190  (via drill 1.02 pad 2.03)
  other vias: 12.7,80.77
N$191  (via drill 1.02 pad 2.03)
  other vias: 10.16,80.77
N$192  (via drill 1.02 pad 2.03)
  other vias: 7.62,80.77
N$193  (via drill 1.02 pad 2.03)
  other vias: 5.08,80.77
N$194  (via drill 1.02 pad 2.03)
  other vias: 5.08,78.23
N$195  (via drill 1.02 pad 2.03)
  other vias: 7.62,78.23
N$196  (via drill 1.02 pad 2.03)
  other vias: 10.16,78.23
N$197  (via drill 1.02 pad 2.03)
  other vias: 12.7,78.23
N$198  (via drill 1.02 pad 2.03)
  other vias: 15.24,78.23
N$199  (via drill 1.02 pad 2.03)
  other vias: 17.78,78.23
N$200  (via drill 1.02 pad 2.03)
  other vias: 20.32,78.23
N$201  (via drill 1.02 pad 2.03)
  other vias: 22.86,78.23
N$202  (via drill 1.02 pad 2.03)
  other vias: 27.94,78.23
N$203  (via drill 1.02 pad 2.03)
  other vias: 25.4,78.23
N$204  (via drill 1.02 pad 2.03)
  other vias: 27.94,75.69
N$205  (via drill 1.02 pad 2.03)
  other vias: 22.86,75.69
N$206  (via drill 1.02 pad 2.03)
  other vias: 25.4,75.69
N$207  (via drill 1.02 pad 2.03)
  other vias: 20.32,75.69
N$208  (via drill 1.02 pad 2.03)
  other vias: 17.78,75.69
N$209  (via drill 1.02 pad 2.03)
  other vias: 15.24,75.69
N$210  (via drill 1.02 pad 2.03)
  other vias: 12.7,75.69
N$211  (via drill 1.02 pad 2.03)
  other vias: 10.16,75.69
N$212  (via drill 1.02 pad 2.03)
  other vias: 5.08,75.69
N$213  (via drill 1.02 pad 2.03)
  other vias: 7.62,75.69
POT1
  Top 0.152: POT1.1 26.98,58.67 26.21,59.44 26.21,59.59 25.91,59.89 24.99,59.89 23.47,58.37 23.47,53.8 20.88,51.21 17.83,51.21 14.33,47.7 14.33,47.4 13.41,46.48 3.96,46.48 3.81,46.33 3.81,33.83 2.59,32.61 J2.2
POT2
  Top 0.152: POT2.1 26.98,56.54 26.98,57.3 27.43,57.76 27.43,59.44 26.67,60.2 24.84,60.2 23.16,58.52 23.16,53.95 20.88,51.66 1.52,51.66 1.22,51.36 1.22,31.24 2.44,30.02 J2.3
POT3  (via drill 0.35)
  Top 0.152: v18.14,43.43 v18.14,50.6 | v15.7,35.81 v18.29,38.41 | v15.7,33.07 15.24,33.07 13.41,31.24 3.96,31.24 3.81,31.09 3.81,28.65 2.59,27.43 J2.4 | POT3.1 26.98,54.41 26.98,54.79 v27.56,55.37
  Bottom 0.152: v18.14,50.6 19.05,51.51 20.73,51.51 24.59,55.37 v27.56,55.37 | v18.14,43.43 18.14,38.56 v18.29,38.41 | v15.7,33.07 v15.7,35.81
RESET  (via drill 0.35)
  Top 0.152: C1.2 20.42,7.01 21.03,7.01 23.47,4.57 ICSP.5 | v15.39,43.43 v15.39,47.85
  Bottom 0.152: R1.2 28.5,7.01 26.06,7.01 23.62,4.57 ICSP.5 | v15.39,47.85 15.24,47.85 12.8,50.29 ATMEGA.1 | v15.39,43.43 15.39,40.84 13.41,38.86 1.37,38.86 1.22,38.71 1.22,16.15 1.37,16 11.28,16 14.33,12.95 14.33,9.3 17.53,6.1 19.36,6.1 20.27,7.01 C1.2
RX
  Bottom 0.152: ATMEGA.2 12.8,47.7 14.63,47.7 15.85,46.48 29.11,46.48 29.87,45.72 29.87,28.65 28.65,27.43 SERIAL.3
TX
  Top 0.152: ATMEGA.3 19.05,38.86 26.52,38.86 26.67,38.71 26.67,31.85 28.5,30.02 SERIAL.2
VEE
  Top 0.152: J3.1 J3.2
  Bottom 0.152: NE5532AP.4 14.02,54.41 19.66,54.41 21.18,55.93 24.38,55.93 29.26,60.81 29.26,82.91 27.58,84.58 J3.1

### Text on the board
tNames: 5V | GND | GND | 5V | AMP1 | AMP2 | A5 | RX | A4 | TX | A3 | 2 | A2 | 3 | A1 | 4 | A0 | CFO EUROPROTO2 | GND | 13 | 12 | 11 | 10 | 9
bNames: CFO / EUROPROTO